# Altium schematic sheet RFID_CU Schematic.SchDoc: Title
size A3; ApprovalDate: dd/mm/yyyy; PageSetup: Record=PageOptions|CenterHorizontal=True|CenterVertical=True|PrintScale=1.01|XCorrection=1.00|YCorrection=1.00|PrintKind=1|BorderSize=5000000|LeftOffset=0|BottomOffset=0|Orientation=2|PaperLength=1000|PaperWidth=1000|Scale=100|PaperSource=7|PrintQuality=600|MediaType=1|DitherType=10|PaperKind=A3 (297 x 420mm)|PrintScaleMode=1; Title2: RFID_CU Schematic; Date: *******; ApprovedBy: *******; CheckedBy: None; Author: *******; CompanyName: *******; DrawnBy: Name; Engineer: *******; Organization: *******; Address1: *******; Address2: *******; Address3: *******; Address4: *******; DocumentNumber: Doc Num; Revision: *******; SheetNumber: 1; SheetTotal: *******; CurrentTime: *******; CurrentDate: *******; Time: *******; DocumentFullPathAndName: *******; DocumentName: *******; ModifiedDate: *******; ImagePath: *******; ProjectName: *******; Application_BuildNumber: *******
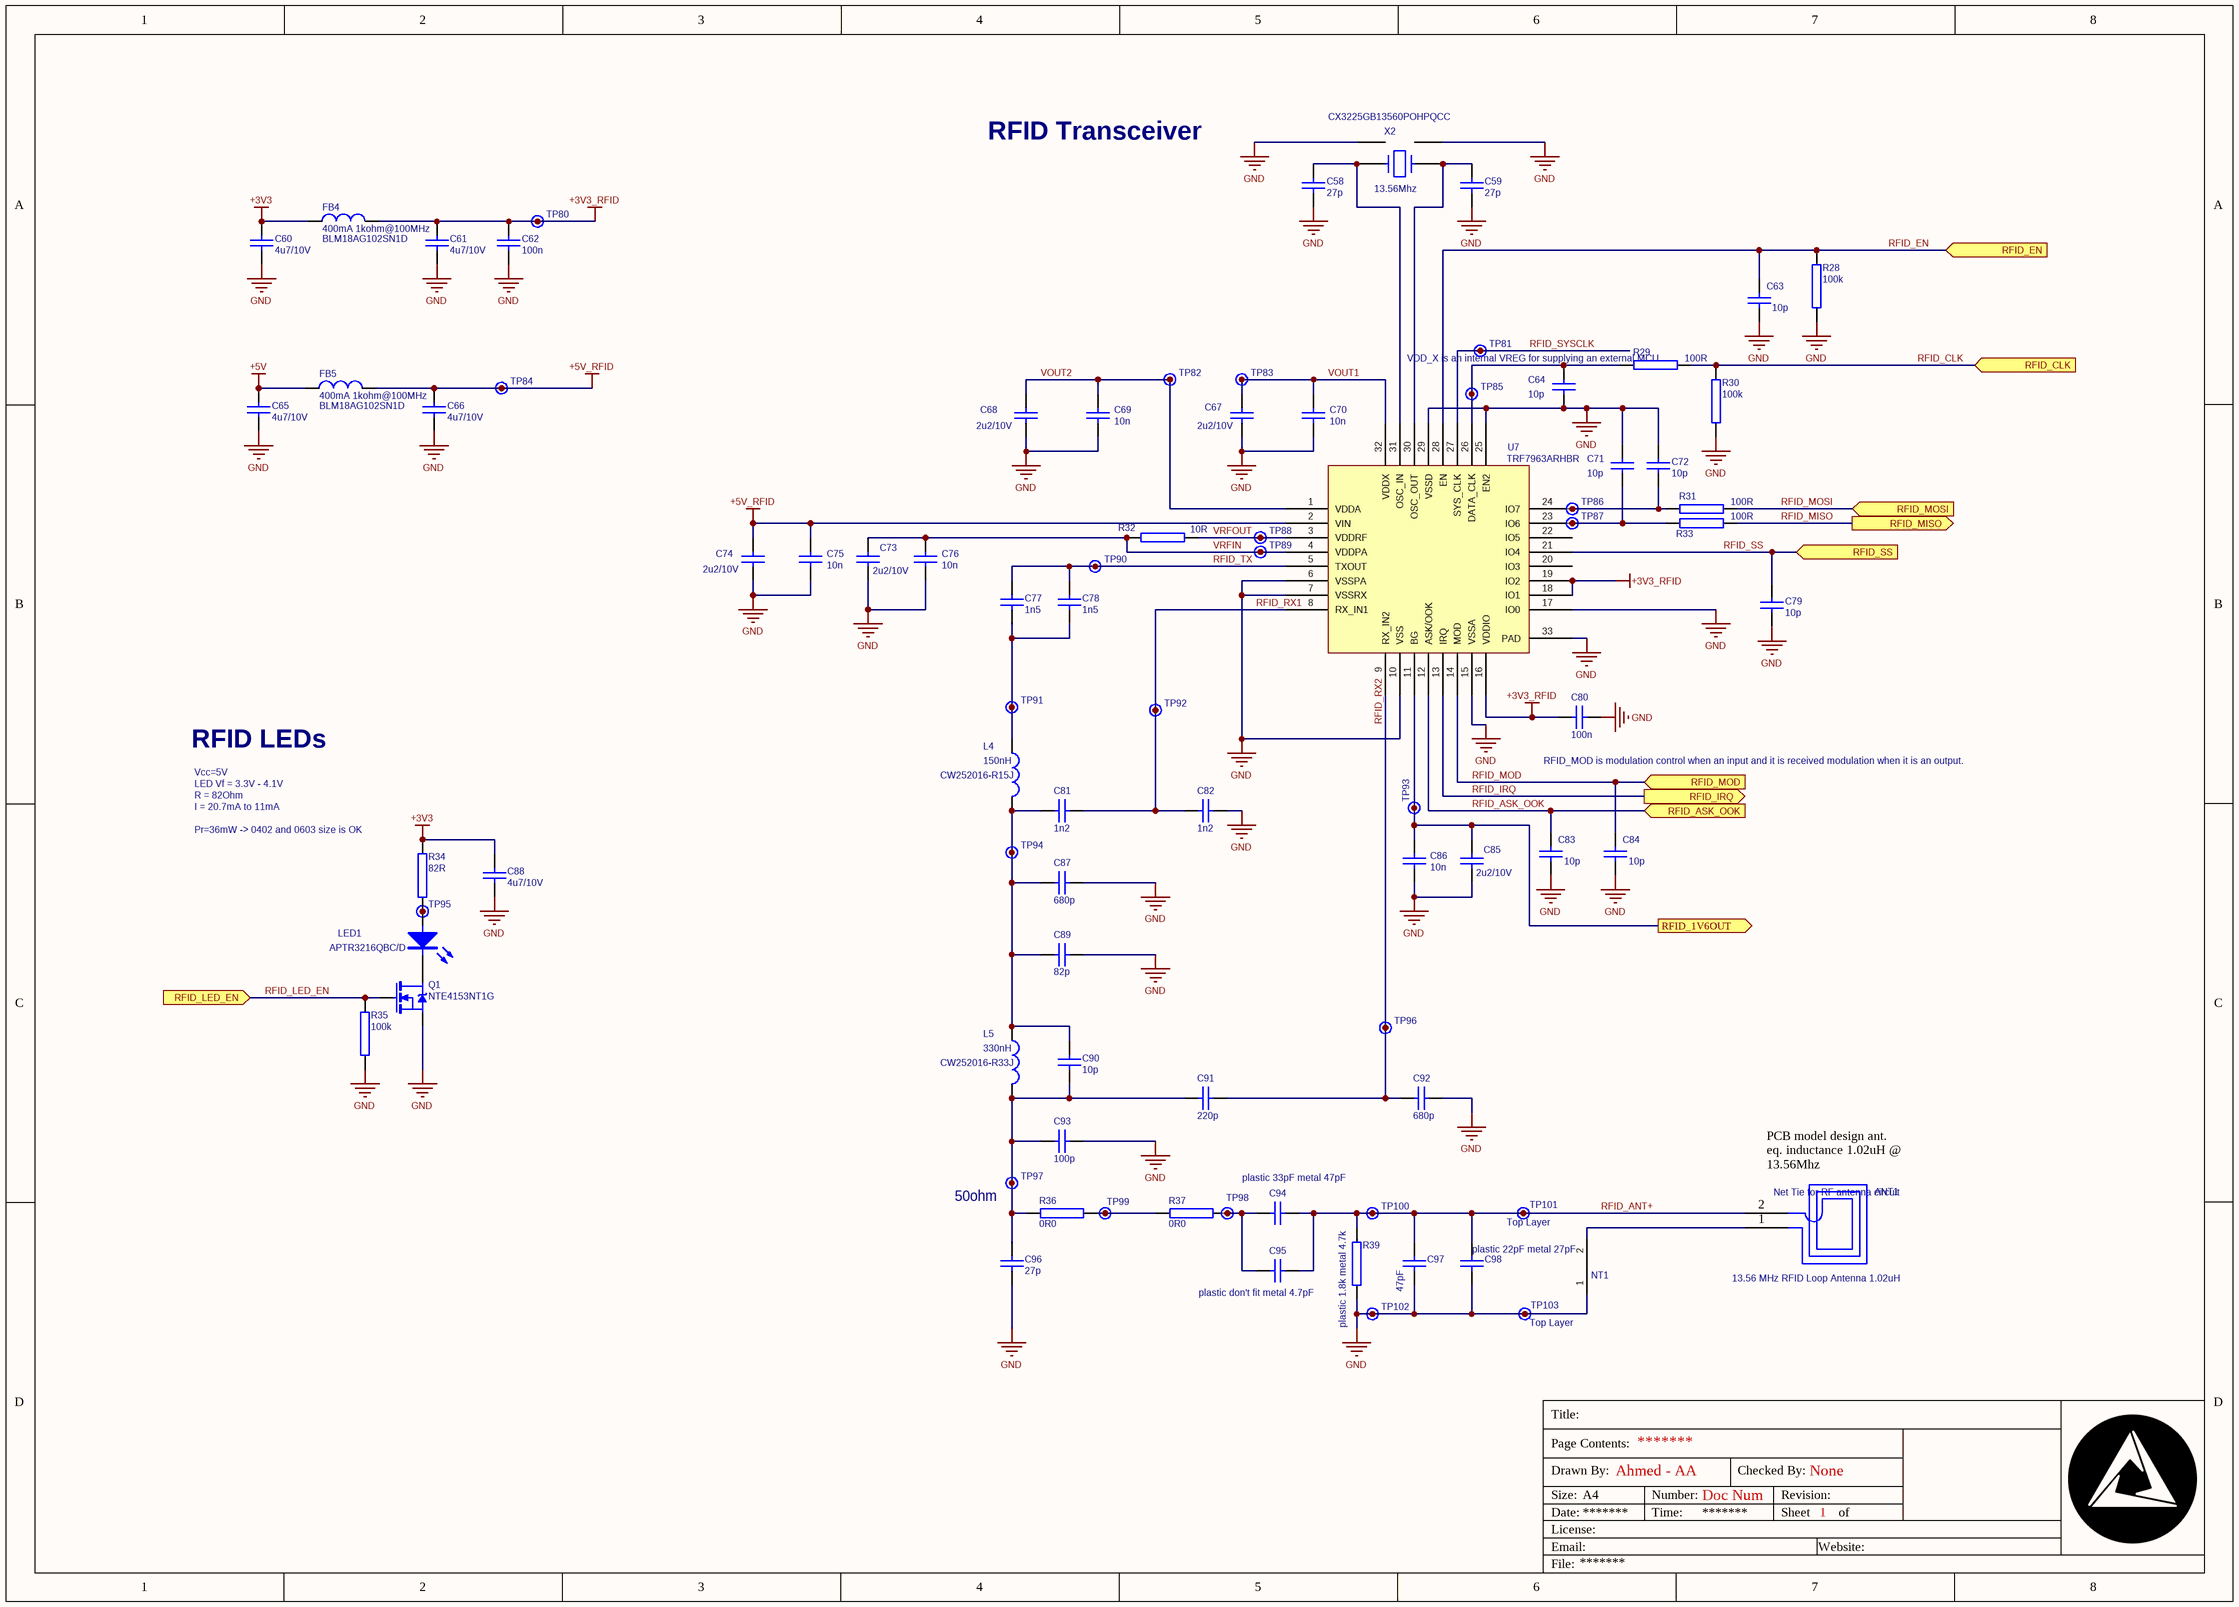
[diagram p0: RFID_CU Schematic.SchDoc]

## Parts
ANT1  Loop Antenna  [loop_antenna]  (value not drawn)
C58  27p  [CAPC1608X09N(0603)]
C59  27p  [CAPC1608X09N(0603)]
C60  4u7/10V  [CAPC1608X09N(0603)]
C61  4u7/10V  [CAPC1608X09N(0603)]
C62  100n  [CAPC1608X09N(0603)]
C63  10p  [CAPC1608X09N(0603)]
C64  10p  [CAPC1608X09N(0603)]
C65  4u7/10V  [CAPC1608X09N(0603)]
C66  4u7/10V  [CAPC1608X09N(0603)]
C67  2u2/10V  [CAPC1608X09N(0603)]
C68  2u2/10V  [CAPC1608X09N(0603)]
C69  10n  [CAPC1608X09N(0603)]
C70  10n  [CAPC1608X09N(0603)]
C71  10p  [CAPC1608X09N(0603)]
C72  10p  [CAPC1608X09N(0603)]
C73  2u2/10V  [CAPC1608X09N(0603)]
C74  2u2/10V  [CAPC1608X09N(0603)]
C75  10n  [CAPC1608X09N(0603)]
C76  10n  [CAPC1608X09N(0603)]
C77  1n5  [CAPC1608X09N(0603)]
C78  1n5  [CAPC1608X09N(0603)]
C79  10p  [CAPC1608X09N(0603)]
C80  100n  [CAPC1608X09N(0603)]
C81  1n2  [CAPC1608X09N(0603)]
C82  1n2  [CAPC1608X09N(0603)]
C83  10p  [CAPC1608X09N(0603)]
C84  10p  [CAPC1608X09N(0603)]
C85  2u2/10V  [CAPC1608X09N(0603)]
C86  10n  [CAPC1608X09N(0603)]
C87  680p  [CAPC1608X09N(0603)]
C88  4u7/10V  [CAPC1608X09N(0603)]
C89  82p  [CAPC1608X09N(0603)]
C90  10p  [CAPC1608X09N(0603)]
C91  220p  [CAPC1608X09N(0603)]
C92  680p  [CAPC1608X09N(0603)]
C93  100p  [CAPC1608X09N(0603)]
C94  plastic 33pF metal 47pF  [CAPC1608X09N(0603)]
C95  plastic don't fit metal 4.7pF  [CAPC1608X09N(0603)]
C96  27p  [CAPC1608X09N(0603)]
C97  47pF  [CAPC1608X09N(0603)]
C98  plastic 22pF metal 27pF  [CAPC1608X09N(0603)]
FB4  400mA 1kohm@100MHz  [RESC1608X06N]
FB5  400mA 1kohm@100MHz  [RESC1608X06N]
L4  150nH  02 Part Number: CW252016-R15J  [CW252016]
L5  330nH  02 Part Number: CW252016-R33J  [CW252016]
LED1  APTR3216QBC/D  [APTR3216QBC/D]
NT1  Net Tie  [0.15mm Net Tie]  (value not drawn)  (net tie, no BOM)
Q1  NTE4153NT1G  [SC-89]
R28  100k  [RESC1608X06N(0603)]
R29  100R  [RESC1608X06N(0603)]
R30  100k  [RESC1608X06N(0603)]
R31  100R  [RESC1608X06N(0603)]
R32  10R  [RESC1608X06N(0603)]
R33  100R  [RESC1608X06N(0603)]
R34  82R  [RESC1608X06N(0603)]
R35  100k  [RESC1608X06N(0603)]
R36  0R0  [RESC1608X06N(0603)]
R37  0R0  [RESC1608X06N(0603)]
R39  plastic 1.8k metal 4.7k  [RESC1608X06N(0603)]
TP80  LFX_P  [Test Point 1mm]  (value not drawn)  (no BOM)
TP81  LFX_P  [Test Point 1mm]  (value not drawn)  (no BOM)
TP82  LFX_P  [Test Point 1mm]  (value not drawn)  (no BOM)
TP83  LFX_P  [Test Point 1mm]  (value not drawn)  (no BOM)
TP84  LFX_P  [Test Point 1mm]  (value not drawn)  (no BOM)
TP85  LFX_P  [Test Point 1mm]  (value not drawn)  (no BOM)
TP86  LFX_P  [Test Point 1mm]  (value not drawn)  (no BOM)
TP87  LFX_P  [Test Point 1mm]  (value not drawn)  (no BOM)
TP88  LFX_P  [Test Point 1mm]  (value not drawn)  (no BOM)
TP89  LFX_P  [Test Point 1mm]  (value not drawn)  (no BOM)
TP90  LFX_P  [Test Point 1mm]  (value not drawn)  (no BOM)
TP91  LFX_P  [Test Point 1mm]  (value not drawn)  (no BOM)
TP92  LFX_P  [Test Point 1mm]  (value not drawn)  (no BOM)
TP93  LFX_P  [Test Point 1mm]  (value not drawn)  (no BOM)
TP94  LFX_P  [Test Point 1mm]  (value not drawn)  (no BOM)
TP95  LFX_P  [Test Point 1mm]  (value not drawn)  (no BOM)
TP96  LFX_P  [Test Point 1mm]  (value not drawn)  (no BOM)
TP97  50ohm  [Test Point 1mm]  (no BOM)
TP98  LFX_P  [Test Point 1mm]  (value not drawn)  (no BOM)
TP99  LFX_P  [Test Point 1mm]  (value not drawn)  (no BOM)
TP100  LFX_P  [Test Point 1mm]  (value not drawn)  (no BOM)
TP101  Notes: Top Layer  [Test Point 1mm]  (hidden comment: LFX_P)  (no BOM)
TP102  LFX_P  [Test Point 1mm]  (value not drawn)  (no BOM)
TP103  Notes: Top Layer  [Test Point 1mm]  (hidden comment: LFX_P)  (no BOM)
U7  TRF7963ARHBR  [QFN-32]
X2  13.56Mhz  02 Part Number: CX3225GB13560POHPQCC  [CX3225GB13560D0HEQCC]

## Ports
RFID_1V6OUT (out), RFID_ASK_OOK (in), RFID_CLK (in), RFID_EN (in), RFID_IRQ (out), RFID_LED_EN (in), RFID_MISO (out), RFID_MOD (in), RFID_MOSI (in), RFID_SS (in)

## Nets
+3V3: C60.2 C88.2 FB4.1 R34.2
+3V3_RFID: C61.2 C62.2 C80.2 FB4.2 TP80.TP U7.16(VDDIO) U7.18(IO1) U7.19(IO2)
+5V: C65.2 FB5.1
+5V_RFID: C66.2 C74.2 C75.2 FB5.2 TP84.TP U7.2(VIN)
GND: C58.1 C59.1 C60.1 C61.1 C62.1 C63.2 C64.2 C65.1 C66.1 C67.1 C68.1 C69.1 C70.1 C71.1 C72.1 C73.1 C74.1 C75.1 C76.1 C79.2 C80.1 C82.1 C83.2 C84.2 C85.1 C86.1 C87.1 C88.1 C89.1 C92.1 C93.1 C96.1 C97.2 C98.2 NT1.1 Q1.S R28.1 R30.1 R35.1 R39.1 TP102.TP TP103.TP U7.6(VSSPA) U7.7(VSSRX) U7.10(VSS) U7.15(VSSA) U7.17(IO0) U7.25(EN2) U7.29(VSSD) U7.33(PAD) X2.2 X2.4
RFID_1V6OUT: C85.2 C86.2 TP93.TP U7.11(BG) ; port RFID_1V6OUT
RFID_ANT+: C94.1 C95.1 C97.1 C98.1 R39.2 TP100.TP TP101.TP
RFID_ASK_OOK: C83.1 U7.12(ASK/OOK) ; port RFID_ASK_OOK
RFID_CLK: R29.2 R30.2 ; port RFID_CLK
RFID_EN: C63.1 R28.2 U7.28(EN) ; port RFID_EN
RFID_IRQ: U7.13(IRQ) ; port RFID_IRQ
RFID_LED_EN: Q1.G R35.2 ; port RFID_LED_EN
RFID_MISO: R33.2 ; port RFID_MISO
RFID_MOD: C84.1 U7.14(MOD) ; port RFID_MOD
RFID_MOSI: R31.2 ; port RFID_MOSI
RFID_RX1: C81.1 C82.2 TP92.TP U7.8(RX_IN1)
RFID_RX2: C91.1 C92.2 TP96.TP U7.9(RX_IN2)
RFID_SS: C79.1 U7.21(IO4) ; port RFID_SS
RFID_SYSCLK: TP81.TP U7.27(SYS_CLK)
RFID_TX: C77.2 C78.2 TP90.TP U7.5(TXOUT)
VOUT1: C67.2 C70.2 TP83.TP U7.32(VDDX)
VOUT2: C68.2 C69.2 TP82.TP U7.1(VDDA)
VRFIN: C73.2 C76.2 R32.1 TP89.TP U7.4(VDDPA)
VRFOUT: R32.2 TP88.TP U7.3(VDDRF)
NetC58_2: C58.2 U7.31(OSC_IN) X2.3
NetC59_2: C59.2 U7.30(OSC_OUT) X2.1
NetC64_1: C64.1 R29.1 TP85.TP U7.26(DATA_CLK)
NetC71_2: C71.2 R33.1 TP87.TP U7.23(IO6)
NetC72_2: C72.2 R31.1 TP86.TP U7.24(IO7)
NetC77_1: C77.1 C78.1 L4.1 TP91.TP
NetC81_2: C81.2 C87.2 C89.2 C90.1 L4.2 L5.1 TP94.TP
NetC90_2: C90.2 C91.2 C93.2 C96.2 L5.2 R36.1 TP97.TP
NetC94_2: C94.2 C95.2 R37.2 TP98.TP
NetLED1_A: LED1.A R34.1 TP95.TP
NetLED1_K: LED1.K Q1.D
NetR36_2: R36.2 R37.1 TP99.TP

Not connected (* = marked no-connect by the designer): ANT1 1 2; NT1 2; U7 20(IO3) 22(IO5)

## Notes on the sheet
- RFID Transceiver
- VDD_X is an internal VREG for supplying an external MCU
- RFID LEDs
- (near C80) RFID_MOD is modulation control when an input and it is received modulation when it is an output.
- (near R34) Vcc=5V
  LED Vf = 3.3V - 4.1V
  R = 82Ohm
  I = 20.7mA to 11mA
  Pr=36mW -> 0402 and 0603 size is OK
- (near ANT1) PCB model design ant. eq. inductance 1.02uH @ 13.56Mhz
- (near ANT1) Net Tie for RF antenna circuit
- (near ANT1) 13.56 MHz RFID Loop Antenna 1.02uH
- Title:
- Drawn By:
- Page Contents:
- Ahmed - AA
- Checked By:
- Size:
- Date:
- File:
- License:
- Email:
- A4
- Number:
- Time:
- Revision:
- Sheet
- Website:
- of

## Library data of the parts
ANT1 = LOOP ANT: FPC Loop Antenna; 02 Part Number: P0000475; 01 Part Category: Atenna; 12 Author: M.Fineschi; 03 Description: FPC Loop Antenna; 04 Value: P0000475
C58 C59 = GRM1885C1H180FA01D: Capacitor, Ceramic, 50V, Tin plated, ±1%, ±30ppm/C, C0G, 100mohm, -55°C to 125°C; 08 Manufacturer: Murata Electronics North America; 04 Value: 18p; 06 Package: 0603; 12 Author: D.Grace; 05 Footprint Type: SMD; 02 Part Number: GRM1885C1H180FA01D; 03 Description: Capacitor, Ceramic, 50V, Tin plated, ±1%, ±30ppm/C, C0G, 100mohm, -55°C to 125°C; 01 Part Category: Capacitor; 09 Digikey PN: GRM1885C1H180FA01D-ND; 10 Alternate Supplier: Mouser; 11 Alternate Supplier PN: 81-GRM1885C1H180FA; ComponentLink1Description: Datasheet; ComponentLink1URL: L:\Datasheet\Capacitor\Chip Monolithic Ceramic Caps.pdf
C60 C61 C65 C66 C88 = CC0603KRX5R6BB475: Capacitor, Ceramic, 10V, ±10%, X5R, -55°C to 125°C; 08 Manufacturer: Yageo; 04 Value: 4u7; 06 Package: 0603; 12 Author: K.Sukumar; 05 Footprint Type: SMD; 02 Part Number: CC0603KRX5R6BB475; 03 Description: Capacitor, Ceramic, 10V, ±10%, X5R, -55°C to 125°C; 01 Part Category: Capacitor; 09 Digikey PN: 311-1455-2-ND; ComponentLink1Description: Datasheet; ComponentLink1URL: L:\Datasheet\Capacitor\mlcc01_e.pdf
C62 C80 = GRM188R71H104KA93D: Capacitor, Ceramic, 50V, ±10%, X7R, -55°C to 125°C; 08 Manufacturer: Murata Electronics North America; 06 Package: 0603; 12 Author: D.Grace; 05 Footprint Type: SMD; 02 Part Number: GRM188R71H104KA93D; 03 Description: Capacitor, Ceramic, 50V, ±10%, X7R, -55°C to 125°C; 04 Value: 100n; 01 Part Category: Capacitor; 09 Digikey PN: 490-1519-2-ND; ComponentLink1Description: Datasheet; ComponentLink1URL: L:\Datasheet\Capacitor\c02e.pdf
C63 C64 C71 C72 C79 C83 C84 C90 = GQM1885C1H100JB01D: Capacitor, Ceramic, 50V, ±5%, NP0, -55°C to 125°C; 08 Manufacturer: Murata Electronics North America; 06 Package: 0603; 12 Author: M.Fineschi; 05 Footprint Type: SMD; 02 Part Number: GQM1885C1H100JB01D; 03 Description: Capacitor, Ceramic, 50V, ±5%, NP0, -55°C to 125°C; 04 Value: 10p; 01 Part Category: Capacitor; 09 Digikey PN: 490-3570-1-ND; ComponentLink1Description: Datasheet; ComponentLink1URL: L:\Datasheet\Capacitor\c02e.pdf
C67 C68 C73 C74 C85 = GRM188R71A225KE15D: Capacitor, Ceramic, 10V, ±10%, X7R, -55°C to 125°C; 08 Manufacturer: Murata Electronics North America; 04 Value: 2u2; 06 Package: 0603; 12 Author: D.Grace; 05 Footprint Type: SMD; 02 Part Number: GRM188R71A225KE15D; 03 Description: Capacitor, Ceramic, 10V, ±10%, X7R, -55°C to 125°C; 01 Part Category: Capacitor; 09 Digikey PN: 490-4520-2-ND; ComponentLink1Description: Datasheet; ComponentLink1URL: L:\Datasheet\Capacitor\c02e.pdf
C69 C70 C75 C76 C86 = GRM188R71H103KA01D: Capacitor, Ceramic, 50V, ±10%, X7R, -55°C to 125°C; 08 Manufacturer: Murata Electronics North America; 06 Package: 0603; 12 Author: D.Grace; 05 Footprint Type: SMD; 02 Part Number: GRM188R71H103KA01D; 03 Description: Capacitor, Ceramic, 50V, ±10%, X7R, -55°C to 125°C; 04 Value: 10n; 01 Part Category: Capacitor; 09 Digikey PN: 490-1512-2-ND; ComponentLink1Description: Datasheet; ComponentLink1URL: L:\Datasheet\Capacitor\c02e.pdf
C77 C78 = GRM188R71H152KA01D: Capacitor, Ceramic, 50V, ±10%, X7R, -55°C to 125°C; 08 Manufacturer: Murata Electronics North America; 06 Package: 0603; 12 Author: M.Fineschi; 05 Footprint Type: SMD; 02 Part Number: GRM188R71H152KA01D; 03 Description: Capacitor, Ceramic, 50V, ±10%, X7R, -55°C to 125°C; 04 Value: 1n5; 01 Part Category: Capacitor; 09 Digikey PN: 490-1498-1-ND; ComponentLink1Description: Datasheet; ComponentLink1URL: L:\Datasheet\Capacitor\c02e.pdf
C81 C82 = GRM188R71H122KA01D: Capacitor, Ceramic, 50V, ±10%, X7R, -55°C to 125°C; 08 Manufacturer: Murata Electronics North America; 06 Package: 0603; 12 Author: M.Fineschi; 05 Footprint Type: SMD; 02 Part Number: GRM188R71H122KA01D; 03 Description: Capacitor, Ceramic, 50V, ±10%, X7R, -55°C to 125°C; 04 Value: 1n2; 01 Part Category: Capacitor; 09 Digikey PN: 490-1496-1-ND; ComponentLink1Description: Datasheet; ComponentLink1URL: L:\Datasheet\Capacitor\c02e.pdf
C87 C92 = GRM188R71H681KA01D: Capacitor, Ceramic, 50V, ±10%, X7R, -55°C to 125°C; 08 Manufacturer: Murata Electronics North America; 06 Package: 0603; 12 Author: M.Fineschi; 05 Footprint Type: SMD; 02 Part Number: GRM188R71H681KA01D; 03 Description: Capacitor, Ceramic, 50V, ±10%, X7R, -55°C to 125°C; 04 Value: 680p; 01 Part Category: Capacitor; 09 Digikey PN: 490-1491-1-ND; ComponentLink1Description: Datasheet; ComponentLink1URL: L:\Datasheet\Capacitor\c02e.pdf
C89 = GRM1885C1H820JA01D: Capacitor, Ceramic, 50V, ±5%, NP0, -55°C to 125°C; 08 Manufacturer: Murata Electronics North America; 06 Package: 0603; 12 Author: M.Fineschi; 05 Footprint Type: SMD; 02 Part Number: GRM1885C1H820JA01D; 03 Description: Capacitor, Ceramic, 50V, ±5%, NP0, -55°C to 125°C; 04 Value: 82p; 01 Part Category: Capacitor; 09 Digikey PN: 490-1425-1-ND; ComponentLink1Description: Datasheet; ComponentLink1URL: L:\Datasheet\Capacitor\c02e.pdf
C91 = GRM188R71H221KA01D: Capacitor, Ceramic, 50V, ±10%, X7R, -55°C to 125°C; 08 Manufacturer: Murata Electronics North America; 06 Package: 0603; 12 Author: M.Fineschi; 05 Footprint Type: SMD; 02 Part Number: GRM188R71H221KA01D; 03 Description: Capacitor, Ceramic, 50V, ±10%, X7R, -55°C to 125°C; 04 Value: 220p; 01 Part Category: Capacitor; 09 Digikey PN: 490-1483-1-ND; ComponentLink1Description: Datasheet; ComponentLink1URL: L:\Datasheet\Capacitor\c02e.pdf
C93 = GRM1885C1H101JA01D: Capacitor, Ceramic, 50V, ±5%, C0G NP0, -55°C to 125°C; 08 Manufacturer: Murata Electronics North America; 06 Package: 0603; 12 Author: D.Grace; 05 Footprint Type: SMD; 02 Part Number: GRM1885C1H101JA01D; 03 Description: Capacitor, Ceramic, 50V, ±5%, C0G NP0, -55°C to 125°C; 04 Value: 100p; 01 Part Category: Capacitor; 09 Digikey PN: 490-1427-2-ND; 10 Alternate Supplier: Mouser; 11 Alternate Supplier PN: 81-GRM39C101J50; ComponentLink1Description: Datasheet; ComponentLink1URL: L:\Datasheet\Capacitor\c02e.pdf
C94 = GRM1885C1H470JA01D: Capacitor, Ceramic, 50V, ±5%, NP0, -55°C to 125°C; 08 Manufacturer: Murata Electronics North America; 06 Package: 0603; 12 Author: M.Fineschi; 05 Footprint Type: SMD; 02 Part Number: GRM1885C1H470JA01D; 03 Description: Capacitor, Ceramic, 50V, ±5%, NP0, -55°C to 125°C; 01 Part Category: Capacitor; 09 Digikey PN: 490-1419-1-ND; ComponentLink1Description: Datasheet; ComponentLink1URL: L:\Datasheet\Capacitor\c02e.pdf
C95 = GQM1885C1H100JB01D: Capacitor, Ceramic, 50V, ±5%, NP0, -55°C to 125°C; 08 Manufacturer: Murata Electronics North America; 04 Value: 22pF; 06 Package: 0603; 12 Author: M.Fineschi; 05 Footprint Type: SMD; 02 Part Number: GQM1885C1H100JB01D; 03 Description: Capacitor, Ceramic, 50V, ±5%, NP0, -55°C to 125°C; 01 Part Category: Capacitor; 09 Digikey PN: 490-3570-1-ND; ComponentLink1Description: Datasheet; ComponentLink1URL: L:\Datasheet\Capacitor\c02e.pdf
C96 = GRM1885C1H270JA01D: Capacitor, Ceramic, 50V, ±5%, NP0, -55°C to 125°C; 08 Manufacturer: Murata Electronics North America; 06 Package: 0603; 12 Author: M.Fineschi; 05 Footprint Type: SMD; 02 Part Number: GRM1885C1H270JA01D; 03 Description: Capacitor, Ceramic, 50V, ±5%, NP0, -55°C to 125°C; 04 Value: 27p; 01 Part Category: Capacitor; 09 Digikey PN: 490-1413-1-ND; ComponentLink1Description: Datasheet; ComponentLink1URL: L:\Datasheet\Capacitor\c02e.pdf
C97 = GRM1885C1H820JA01D: Capacitor, Ceramic, 50V, ±5%, NP0, -55°C to 125°C; 08 Manufacturer: Murata Electronics North America; 04 Value: 100p; 06 Package: 0603; 12 Author: M.Fineschi; 05 Footprint Type: SMD; 02 Part Number: GRM1885C1H820JA01D; 03 Description: Capacitor, Ceramic, 50V, ±5%, NP0, -55°C to 125°C; 01 Part Category: Capacitor; 09 Digikey PN: 490-1425-1-ND; ComponentLink1Description: Datasheet; ComponentLink1URL: L:\Datasheet\Capacitor\c02e.pdf
C98 = GRM1885C1H101JA01D: Capacitor, Ceramic, 50V, ±5%, C0G NP0, -55°C to 125°C; 08 Manufacturer: Murata Electronics North America; 04 Value: 10p; 06 Package: 0603; 12 Author: D.Grace; 05 Footprint Type: SMD; 02 Part Number: GRM1885C1H101JA01D; 03 Description: Capacitor, Ceramic, 50V, ±5%, C0G NP0, -55°C to 125°C; 01 Part Category: Capacitor; 09 Digikey PN: 490-1427-2-ND; 10 Alternate Supplier: Mouser; 11 Alternate Supplier PN: 81-GRM39C101J50; ComponentLink1Description: Datasheet; ComponentLink1URL: L:\Datasheet\Capacitor\c02e.pdf
FB4 FB5 = BLM18AG102SN1D: Ferrite Bead, 1kohm@100MHz, 400mA, 500mohm, -55 to 125C; 01 Part Category: Filter; 08 Manufacturer: Murata; 06 Package: 0603; 05 Footprint Type: SMD; 12 Author: M.Fineschi; 02 Part Number: BLM18AG102SN1D; 03 Description: Ferrite Bead, 1kohm@100MHz, 400mA, 500mohm, -55 to 125C; 04 Value: 1kohm@100MHz; ComponentLink1Description: Datasheet; ComponentLink1URL: L:\Datasheet\Filter\L0110S0100BLM18A.pdf; 09 Digikey PN: 490-1015-2-ND; 10 Alternate Supplier: BLM18AG102SN1D
L4 = CW252016-R15J_PA: Inductor, 150nH , I = 500mA, 220 mOhm, SRF 850MHz, ±5%; 01 Part Category: Passive; 08 Manufacturer: Bourns Inc; 06 Package: 1008; 05 Footprint Type: SMD; 12 Author: D.Grace; 13 Reviewed By: P.Moutzouris; 03 Description: Inductor, 150nH , I = 500mA, 220 mOhm, SRF 850MHz, ±5%; 04 Value: 150nH; ComponentLink1Description: Datasheet; ComponentLink1URL: L:\Datasheet\Inductor\CW252016.pdf; 09 Digikey PN: CW252016-R15JTR-ND
L5 = CW252016-R33J_PA: Inductor, 330nH , I = 500mA, 900 mOhm, SRF 570MHz, ±5%; 01 Part Category: Passive; 08 Manufacturer: Bourns Inc; 06 Package: 1008; 05 Footprint Type: SMD; 12 Author: D.Grace; 13 Reviewed By: P.Moutzouris; 03 Description: Inductor, 330nH , I = 500mA, 900 mOhm, SRF 570MHz, ±5%; 04 Value: 330nH; ComponentLink1Description: Datasheet; ComponentLink1URL: L:\Datasheet\Inductor\CW252016.pdf; 09 Digikey PN: CW252016-R33JTR-ND
LED1 = KPTR-3216ZGC: LED, TopEntry, Blue, 4000mcd, 20mA, Vf=3V3; 01 Part Category: Discrete; 08 Manufacturer: Kingbright; 06 Package: 1206; 05 Footprint Type: SMD; 12 Author: M.Fineschi; 03 Description: LED, Top Entry, Blue, 4000mcd, 20mA, Vf=3V3; 04 Value: APTR3216QBC/D; ComponentLink1Description: Datasheet; 09 Digikey PN: -; 10 Alternate Supplier: Element14; 11 Alternate Supplier PN: 2217988; 02 Part Number: APTR3216QBC/D
Q1 = NTE4153NT1G: MOSFET, N-Channel, Logic Level, 0.5Ohm @ 1.5V, Vds 50V, Id 915mA, 300mW; 01 Part Category: Discrete; 08 Manufacturer: On Semiconductor; 05 Footprint Type: SMD; 12 Author: D.Grace; 02 Part Number: NTE4153NT1G; 03 Description: Logic Level, 0.5Ohm @ 1.5V, Vds 50V, Id 915mA, 300mW; 04 Value: NTE4153NT1G; 06 Package: SC-89; ComponentLink1Description: Datasheet; ComponentLink1URL: L:\Datasheet\Discrete\NTA4153N-D.pdf; 09 Digikey PN: NTE4153NT1GOSTR-ND
R28 R30 R35 = RC0603FR-07100KL: Resistor, Thick Film, 0.1W, ±1%, ±100ppm/°C; 08 Manufacturer: Yageo; 13 Reviewed By: P.Moutzouris; 06 Package: 0603; 12 Author: D.Grace; 05 Footprint Type: SMD; 02 Part Number: RC0603FR-07100KL; 03 Description: Resistor, Thick Film, 0.1W, ±1%, ±100ppm/°C; 04 Value: 100k; 09 Digikey PN: 311-100KHRTR-ND; 01 Part Category: Resistor; ComponentLink1Description: Datasheet; ComponentLink1URL: L:\Datasheet\Resistor\PYu-RC0603_51_RoHS_L_4.pdf
R29 R31 R33 = RC0603FR-07100RL: Resistor, Thick Film, 0.1W, ±1%, ±100ppm/°C; 08 Manufacturer: Yageo; 13 Reviewed By: P.Moutzouris; 06 Package: 0603; 12 Author: D.Grace; 05 Footprint Type: SMD; 02 Part Number: RC0603FR-07100RL; 03 Description: Resistor, Thick Film, 0.1W, ±1%, ±100ppm/°C; 04 Value: 100R; 09 Digikey PN: 311-100HRTR-ND; 01 Part Category: Resistor; ComponentLink1Description: Datasheet; ComponentLink1URL: L:\Datasheet\Resistor\PYu-RC0603_51_RoHS_L_4.pdf
R32 = RC0603FR-0710RL: Resistor, Thick Film, 0.1W, ±1%, ±100ppm/°C; 08 Manufacturer: Yageo; 06 Package: 0603; 12 Author: M.Fineschi; 05 Footprint Type: SMD; 03 Description: Resistor, Thick Film, 0.1W, ±1%, ±100ppm/°C; 04 Value: 10R; 09 Digikey PN: 311-10.0HRCT-ND; 01 Part Category: Resistor; ComponentLink1Description: Datasheet; ComponentLink1URL: L:\Datasheet\Resistor\PYu-RC0603_51_RoHS_L_4.pdf; 02 Part Number: RC0603FR-0710RL
R34 = RC0603FR-0782RL: Resistor, Thick Film, 0.1W, ±1%, ±100ppm/°C; 08 Manufacturer: Yageo; 13 Reviewed By: P.Moutzouris; 06 Package: 0603; 12 Author: D.Grace; 05 Footprint Type: SMD; 02 Part Number: RC0603FR-0782RL; 03 Description: Resistor, Thick Film, 0.1W, ±1%, ±100ppm/°C; 04 Value: 82R; 09 Digikey PN: 311-82.0HRTR-ND; 01 Part Category: Resistor; ComponentLink1Description: Datasheet; ComponentLink1URL: L:\Datasheet\Resistor\PYu-RC0603_51_RoHS_L_4.pdf
R36 R37 = RC1608J000CS: Resistor, Thick Film, 0.1W, ±1%, ±100ppm/°C; 08 Manufacturer: Samsung Electro-Mechanics; 13 Reviewed By: P.Moutzouris; 06 Package: 0603; 12 Author: K.Sukumar; 05 Footprint Type: SMD; 02 Part Number: RC1608J000CS; 03 Description: Resistor, Thick Film, 0.1W, ±1%, ±100ppm/°C; 04 Value: 0R0; 09 Digikey PN: 1276-3510-2-ND; 01 Part Category: Resistor; ComponentLink1Description: Datasheet; ComponentLink1URL: L:\Datasheet\Resistor\Chip_Resistor.pdf
R39 = RC0603FR-071KL: Resistor, Thick Film, 0.1W, ±1%, ±100ppm/°C; 08 Manufacturer: Yageo; 13 Reviewed By: P.Moutzouris; 06 Package: 0603; 12 Author: D.Grace; 05 Footprint Type: SMD; 02 Part Number: RC0603FR-071KL; 03 Description: Resistor, Thick Film, 0.1W, ±1%, ±100ppm/°C; 04 Value: 1.8k; 09 Digikey PN: 311-1.00KHRTR-ND; 01 Part Category: Resistor; ComponentLink1Description: Datasheet; ComponentLink1URL: L:\Datasheet\Resistor\PYu-RC0603_51_RoHS_L_4.pdf
TP80-TP103 = Test Point: 01 Part Category: PCB; 12 Author: D.Grace
U7 = TRF7963ARHBR: RFID/NFC AFE 13.56MHZ; 01 Part Category: IC; 08 Manufacturer: TI; 03 Description: IC RFID FRONT END 13.56MHZ; 05 Footprint Type: SMD; 12 Author: K.Sukumar; 02 Part Number: TRF7963ARHBR; 04 Value: TRF7963ARHBR; 06 Package: QFN-32; ComponentLink1Description: Datasheet; ComponentLink1URL: L:\Datasheet\IC\trf7963a.pdf; 09 Digikey PN: TRF7963ARHBR-ND
X2 = 7A-13.560MAAJ-T: Crystal, 13.56Mhz, 18pF, +-30ppm, 50Ohm, Fundamental; 08 Manufacturer: AVX Corp/Kyocera Corp; 03 Description: CRYSTAL 13.56MHZ 27PF SMD; 06 Package: SMD-4; 05 Footprint Type: SMD; 12 Author: J.Orhan; 04 Value: CX3225GB13560POHPQCC; 01 Part Category: Crystal; ComponentLink1Description: Datasheet; ComponentLink1URL: L:\Datasheet\Crystal\CX3225GBxD0HEQ_Series_Spec.pdf; 09 Digikey PN: 1253-1173-1-ND